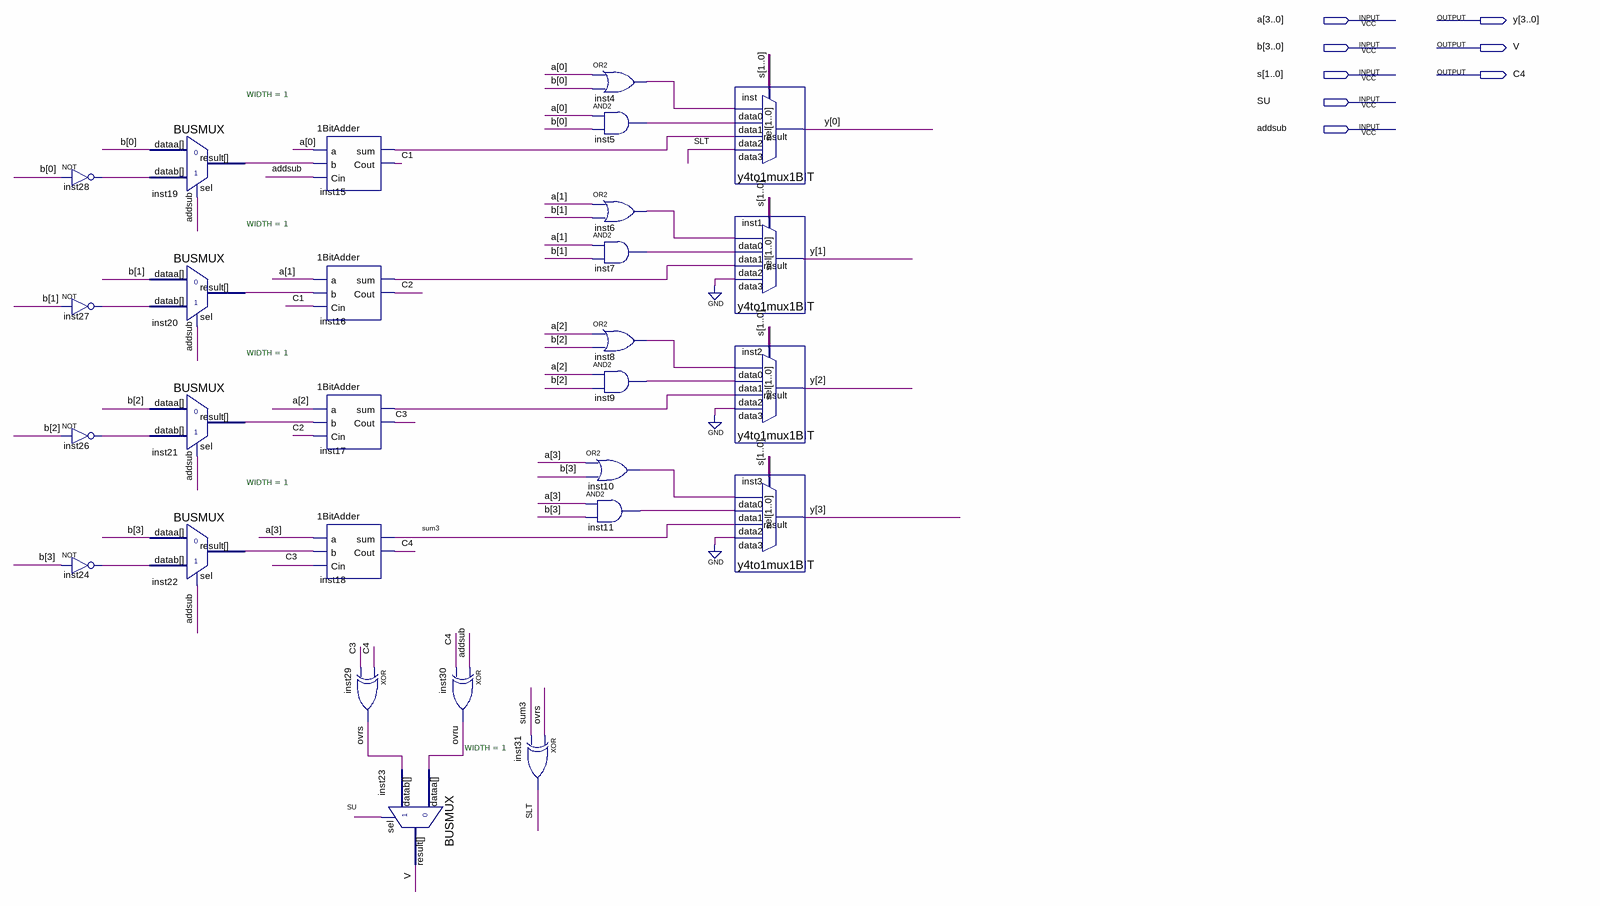
[diagram p0: schematic sheet]
// Quartus schematic 4BitALUDesign.bdf as structural Verilog: 28 symbols, 8 pins
module \4BitALUDesign  (
  input  [3:0] a,
  input  [3:0] b,
  input  [1:0] s,
  input  SU,
  input  addsub,
  output [3:0] y,
  output V,
  output C4
);

  wire C1, C2, C3, inst4_out, inst5_out, inst6_out, inst7_out, inst8_out, inst9_out, inst10_out, inst11_out,
       inst15_sum, inst16_sum, inst17_sum, inst19_result, inst20_result, inst21_result, inst22_result,
       inst24_out, inst26_out, inst27_out, inst28_out, ovrs, ovru, SLT, sum3;

  not inst28 (inst28_out, b[0]);
  not inst27 (inst27_out, b[1]);
  not inst26 (inst26_out, b[2]);
  not inst24 (inst24_out, b[3]);
  BUSMUX #(.WIDTH(1)) inst19 (.datab(inst28_out), .sel(addsub), .dataa(b[0]), .result(inst19_result));
  BUSMUX #(.WIDTH(1)) inst20 (.datab(inst27_out), .sel(addsub), .dataa(b[1]), .result(inst20_result));
  BUSMUX #(.WIDTH(1)) inst21 (.datab(inst26_out), .sel(addsub), .dataa(b[2]), .result(inst21_result));
  BUSMUX #(.WIDTH(1)) inst22 (.datab(inst24_out), .sel(addsub), .dataa(b[3]), .result(inst22_result));
  \1BitAdder  inst15 (.a(a[0]), .b(inst19_result), .Cin(addsub), .sum(inst15_sum), .Cout(C1));
  \1BitAdder  inst16 (.a(a[1]), .b(inst20_result), .Cin(C1), .sum(inst16_sum), .Cout(C2));
  \1BitAdder  inst17 (.a(a[2]), .b(inst21_result), .Cin(C2), .sum(inst17_sum), .Cout(C3));
  \1BitAdder  inst18 (.a(a[3]), .b(inst22_result), .Cin(C3), .sum(sum3), .Cout(C4));
  xor inst29 (ovrs, C4, C3);
  BUSMUX #(.WIDTH(1)) inst23 (.datab(ovrs), .sel(SU), .dataa(ovru), .result(V));
  xor inst30 (ovru, addsub, C4);
  xor inst31 (SLT, ovrs, sum3);
  or inst4 (inst4_out, a[0], b[0]);
  and inst5 (inst5_out, a[0], b[0]);
  or inst6 (inst6_out, a[1], b[1]);
  and inst7 (inst7_out, a[1], b[1]);
  or inst8 (inst8_out, a[2], b[2]);
  and inst9 (inst9_out, a[2], b[2]);
  or inst10 (inst10_out, a[3], b[3]);
  and inst11 (inst11_out, a[3], b[3]);
  y4to1mux1BIT inst (.data3(SLT), .data2(inst15_sum), .data1(inst5_out), .data0(inst4_out), .sel(s), .result(y[0]));
  y4to1mux1BIT inst1 (.data3(1'b0), .data2(inst16_sum), .data1(inst7_out), .data0(inst6_out), .sel(s), .result(y[1]));
  y4to1mux1BIT inst2 (.data3(1'b0), .data2(inst17_sum), .data1(inst9_out), .data0(inst8_out), .sel(s), .result(y[2]));
  y4to1mux1BIT inst3 (.data3(1'b0), .data2(sum3), .data1(inst11_out), .data0(inst10_out), .sel(s), .result(y[3]));
endmodule
